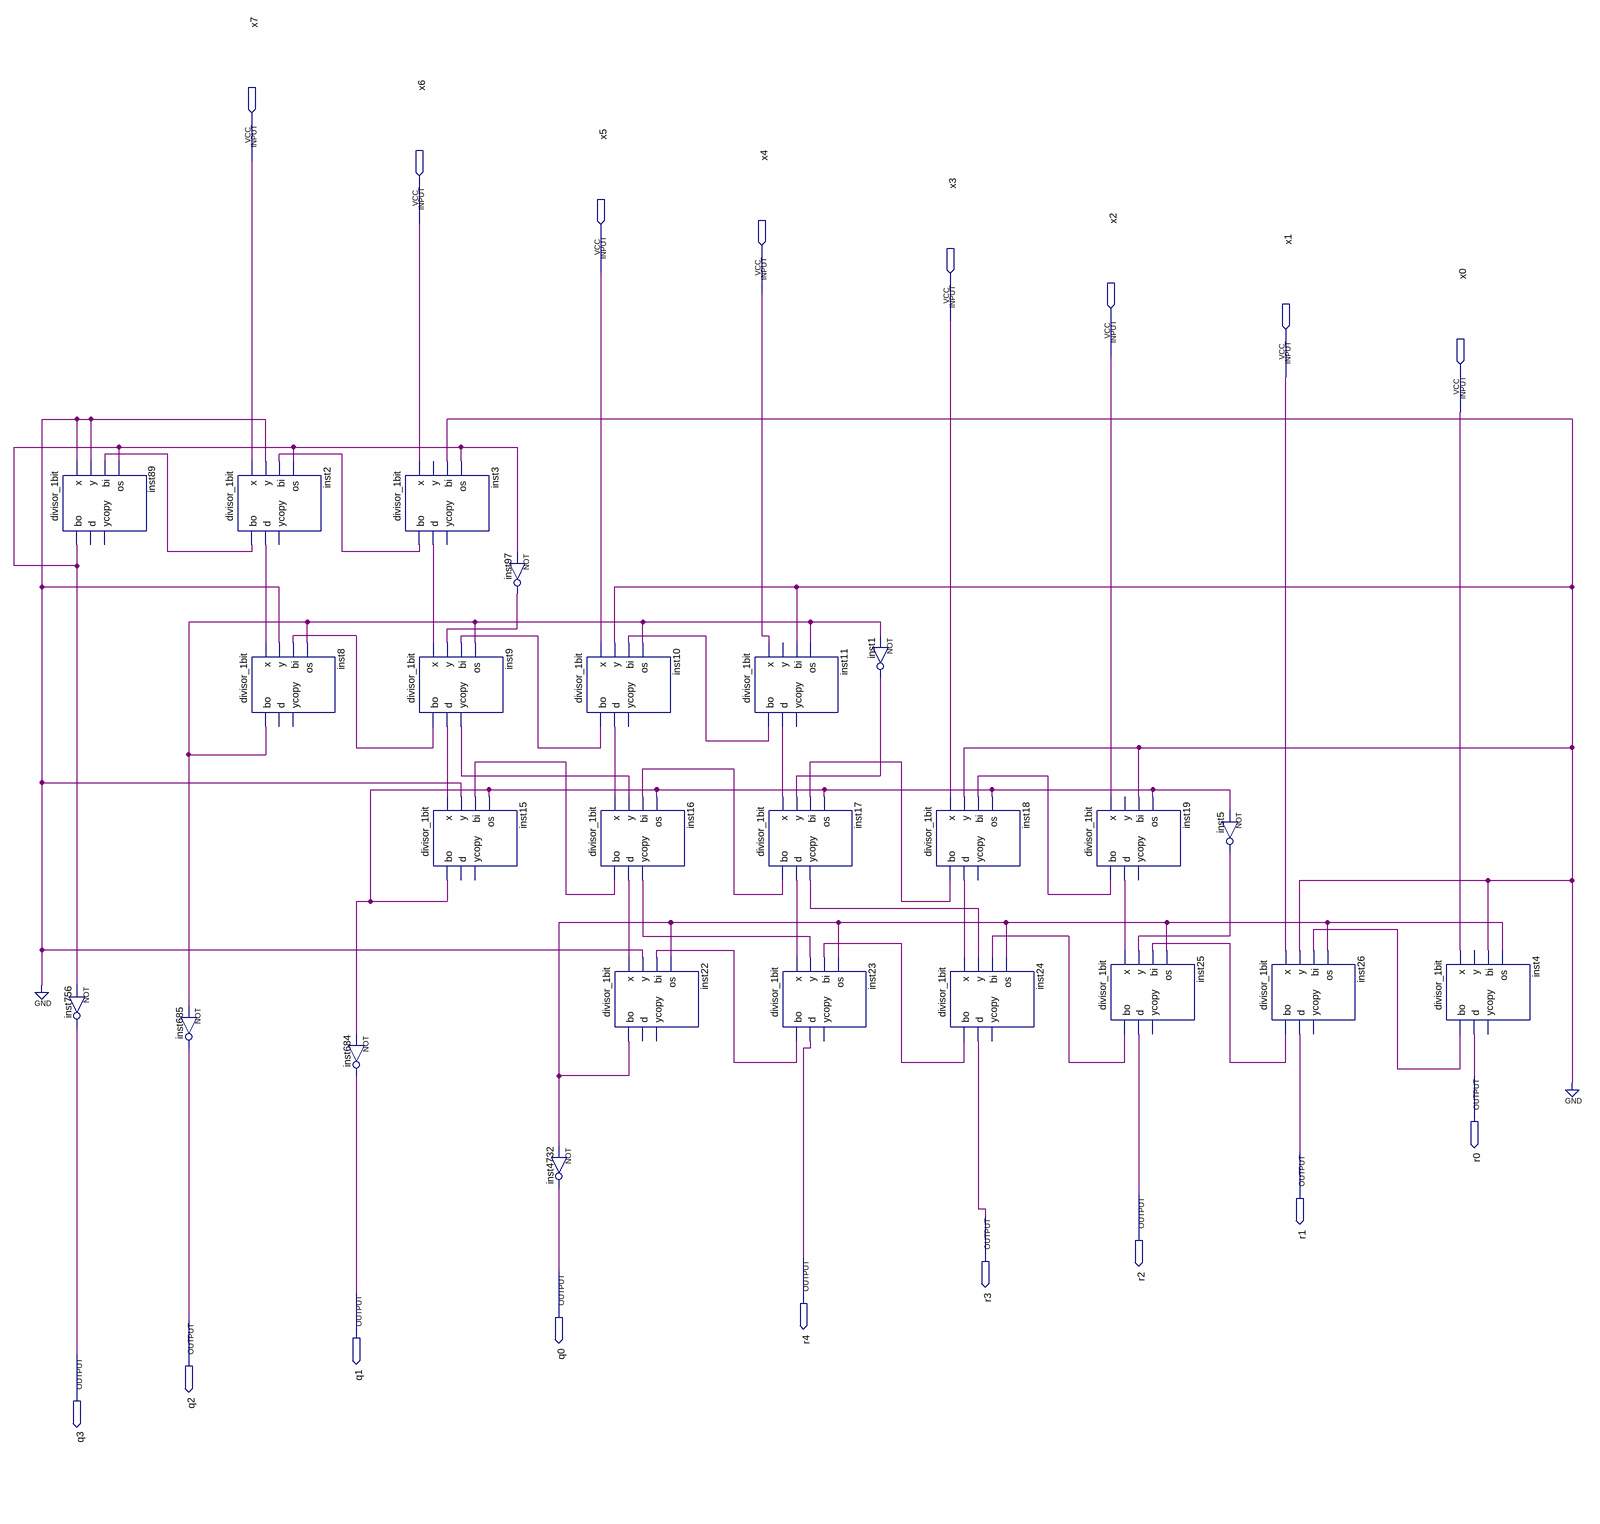
[diagram p0: schematic sheet]
// Quartus schematic sqrt_structure.bdf as structural Verilog: 25 symbols, 17 pins
module sqrt_structure (
  input  x7,
  input  x6,
  input  x5,
  input  x4,
  input  x3,
  input  x2,
  input  x1,
  input  x0,
  output r0,
  output r1,
  output r2,
  output r3,
  output r4,
  output q0,
  output q1,
  output q2,
  output q3
);

  wire inst1_out, inst2_bo, inst2_d, inst3_bo, inst3_d, inst4_bo, inst5_out, inst8_bo, inst9_bo, inst9_d,
       inst9_ycopy, inst10_bo, inst10_d, inst11_bo, inst11_d, inst15_bo, inst16_bo, inst16_d, inst16_ycopy,
       inst17_bo, inst17_d, inst17_ycopy, inst18_bo, inst18_d, inst19_bo, inst19_d, inst22_bo, inst23_bo,
       inst24_bo, inst25_bo, inst26_bo, inst89_bo, inst97_out;

  divisor_1bit inst89 (.x(1'b0), .y(1'b0), .bi(inst2_bo), .os(inst89_bo), .bo(inst89_bo));  // open: d, ycopy
  not inst756 (q3, inst89_bo);
  not inst685 (q2, inst8_bo);
  divisor_1bit inst2 (.x(x7), .y(1'b0), .bi(inst3_bo), .os(inst89_bo), .bo(inst2_bo), .d(inst2_d));  // open: ycopy
  divisor_1bit inst8 (.x(inst2_d), .y(1'b0), .bi(inst9_bo), .os(inst8_bo), .bo(inst8_bo));  // open: d, ycopy
  not inst684 (q1, inst15_bo);
  divisor_1bit inst3 (.x(x6), .bi(1'b0), .os(inst89_bo), .bo(inst3_bo), .d(inst3_d));  // open: y, ycopy
  divisor_1bit inst9 (
    .x(inst3_d), .y(inst97_out), .bi(inst10_bo), .os(inst8_bo), .bo(inst9_bo), .d(inst9_d),
    .ycopy(inst9_ycopy));
  divisor_1bit inst15 (.x(inst9_d), .y(1'b0), .bi(inst16_bo), .os(inst15_bo), .bo(inst15_bo));  // open: d, ycopy
  not inst97 (inst97_out, inst89_bo);
  divisor_1bit inst10 (.x(x5), .y(1'b0), .bi(inst11_bo), .os(inst8_bo), .bo(inst10_bo), .d(inst10_d));  // open: ycopy
  not inst4732 (q0, inst22_bo);
  divisor_1bit inst16 (
    .x(inst10_d), .y(inst9_ycopy), .bi(inst17_bo), .os(inst15_bo), .bo(inst16_bo), .d(inst16_d),
    .ycopy(inst16_ycopy));
  divisor_1bit inst22 (.x(inst16_d), .y(1'b0), .bi(inst23_bo), .os(inst22_bo), .bo(inst22_bo));  // open: d, ycopy
  divisor_1bit inst11 (.x(x4), .bi(1'b0), .os(inst8_bo), .bo(inst11_bo), .d(inst11_d));  // open: y, ycopy
  divisor_1bit inst17 (
    .x(inst11_d), .y(inst1_out), .bi(inst18_bo), .os(inst15_bo), .bo(inst17_bo), .d(inst17_d),
    .ycopy(inst17_ycopy));
  divisor_1bit inst23 (
    .x(inst17_d), .y(inst16_ycopy), .bi(inst24_bo), .os(inst22_bo), .bo(inst23_bo), .d(r4));  // open: ycopy
  not inst1 (inst1_out, inst8_bo);
  divisor_1bit inst18 (.x(x3), .y(1'b0), .bi(inst19_bo), .os(inst15_bo), .bo(inst18_bo), .d(inst18_d));  // open: ycopy
  divisor_1bit inst24 (
    .x(inst18_d), .y(inst17_ycopy), .bi(inst25_bo), .os(inst22_bo), .bo(inst24_bo), .d(r3));  // open: ycopy
  divisor_1bit inst19 (.x(x2), .bi(1'b0), .os(inst15_bo), .bo(inst19_bo), .d(inst19_d));  // open: y, ycopy
  divisor_1bit inst25 (
    .x(inst19_d), .y(inst5_out), .bi(inst26_bo), .os(inst22_bo), .bo(inst25_bo), .d(r2));  // open: ycopy
  not inst5 (inst5_out, inst15_bo);
  divisor_1bit inst26 (.x(x1), .y(1'b0), .bi(inst4_bo), .os(inst22_bo), .bo(inst26_bo), .d(r1));  // open: ycopy
  divisor_1bit inst4 (.x(x0), .bi(1'b0), .os(inst22_bo), .bo(inst4_bo), .d(r0));  // open: y, ycopy
endmodule
